# EAGLE design newboard (EAGLE 9.6.2)
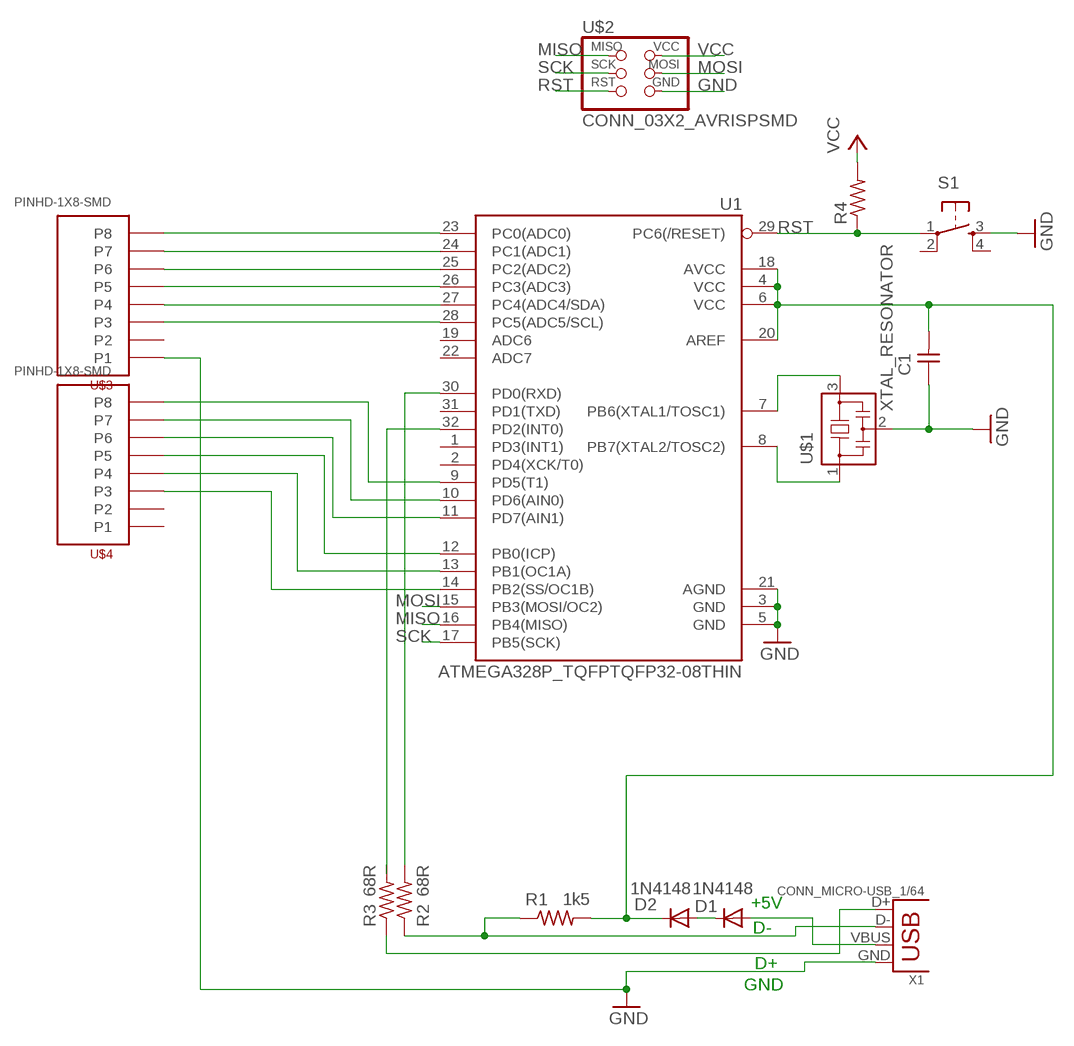
[diagram p0: schematic, sheet 1]

## Parts
C1  CAP_UNPOLARIZEDFAB  [C1206FAB]
D1  1N4148  [DO35-10]
D2  1N4148  [DO35-10]
R1  1k5  R1206FAB  [R1206FAB]
R2  68R  R1206FAB  [R1206FAB]
R3  68R  R1206FAB  [R1206FAB]
R4  R1206FAB  [R1206FAB]
S1  SW_SWITCH_TACTILE_6MM6MM_SWITCH  [6MM_SWITCH]
U1  ATMEGA328P_TQFPTQFP32-08THIN  [TQFP32-08THIN]
U$1  XTAL_RESONATOR  [EFOBM]
U$2  CONN_03X2_AVRISPSMD  [2X03SMD]
U$3  PINHD-1X8-SMD  [1X08SMD]
U$4  PINHD-1X8-SMD  [1X08SMD]
X1  CONN_MICRO-USB_1/64  [DX4R005HJ5_64]

## Nets
GND: C1.1 S1.3(S) U1.3(GND) U1.5(GND) U1.21(AGND) U$1.2 U$2.6(GND) U$3.P1 X1.GND
MISO: U1.16(PB4(MISO)) U$2.1(MISO)
MOSI: U1.15(PB3(MOSI/OC2)) U$2.4(MOSI)
N$1: U1.23(PC0(ADC0)) U$3.P8
N$2: U1.24(PC1(ADC1)) U$3.P7
N$3: U1.7(PB6(XTAL1/TOSC1)) U$1.3
N$4: U1.8(PB7(XTAL2/TOSC2)) U$1.1
N$5: U1.25(PC2(ADC2)) U$3.P6
N$6: U1.26(PC3(ADC3)) U$3.P5
N$7: R2.2 U1.30(PD0(RXD))
N$8: R3.2 U1.32(PD2(INT0))
N$9: U1.27(PC4(ADC4/SDA)) U$3.P4
N$10: U1.28(PC5(ADC5/SCL)) U$3.P3
N$11: U1.9(PD5(T1)) U$4.P8
N$12: U1.10(PD6(AIN0)) U$4.P7
N$13: U1.11(PD7(AIN1)) U$4.P6
N$14: U1.13(PB1(OC1A)) U$4.P4
N$15: U1.14(PB2(SS/OC1B)) U$4.P3
N$18: R1.1 R2.1 X1.D-
N$19: R3.1 X1.D+
N$24: D1.A X1.VBUS
N$25: D1.C D2.A
N$26: U1.12(PB0(ICP)) U$4.P5
RST: R4.1 S1.1(P) U1.29(PC6(/RESET)) U$2.5(RST)
SCK: U1.17(PB5(SCK)) U$2.3(SCK)
VCC: C1.2 D2.C R1.2 R4.2 U1.4(VCC) U1.6(VCC) U1.18(AVCC) U1.20(AREF) U$2.2(VCC)
Unconnected: S1.2(P1) S1.4(S1) U1.1(PD3(INT1)) U1.2(PD4(XCK/T0)) U1.19(ADC6) U1.22(ADC7) U1.31(PD1(TXD)) U$3.P2 U$4.P1 U$4.P2

## Notes on the sheet
- +5V
- D-
- D+
- GND

## Library data of the parts
C1 = 00fab:CAP_UNPOLARIZED
D1 D2 = diode:1N4148: DIODE high speed (Philips)
R1-R4 = 00fab:R: Resistor (US Symbol) Variants with postfix FAB are widened to allow the routing of internal traces
S1 = 00fab:SW_SWITCH_TACTILE_6MM: OMRON SWITCH
U1 = 01fab:ATMEGA328P_TQFP
U$1 = 00fab:XTAL_RESONATOR
U$2 = 00fab:CONN_03X2_AVRISP
U$3 U$4 = 01fab:PINHD-1X8-SMD: M1x08 SMD Header
X1 = 00fab:CONN_MICRO-USB: SMD micro USB connector as found in the fablab inventory. Three footprint variants included: original, as described by manufacturer's datasheet for milling with the 1/100" bit for milling with the 1/64" bit Made by Zaerc.

## Board
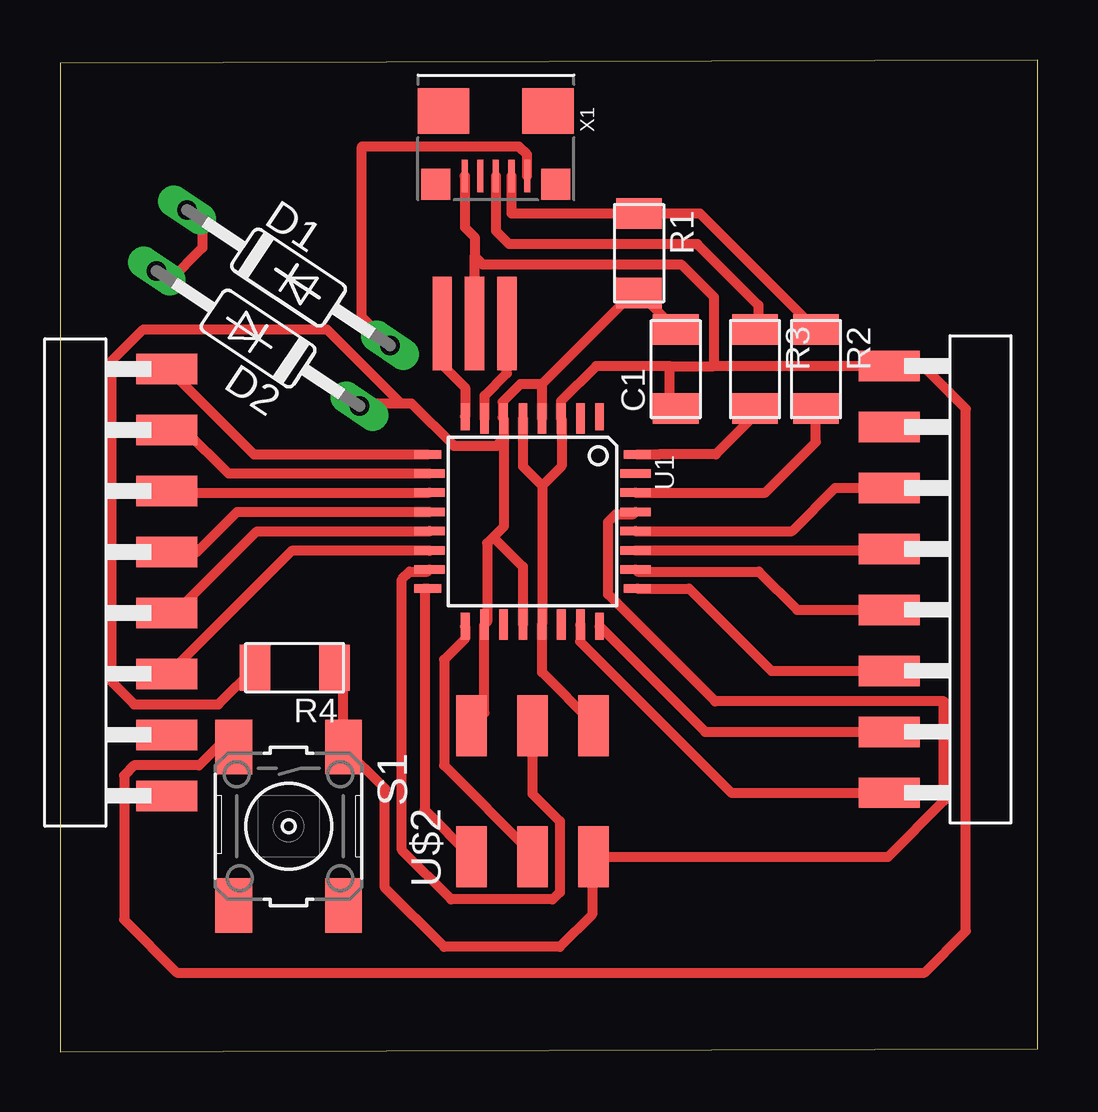
[diagram p1: board, top side]

Size 40.75 x 41.33 mm. Coordinates in mm from the lower left corner, seen from the top.
Outline: 0,0 40.75,0.13 40.75,41.33 0,41.2 0,0
Copper layers (1*16): Top 0.035mm / dielectric 1.5mm / Bottom 0.035mm
Design rules "default *": minimum track width 8mil, minimum drill 0.35mm, track to track 8mil, track to pad 12mil, pad to pad 12mil, via to via 12mil, smd to smd 0mil, copper to edge 40mil, drill to drill 12mil, minimum pad ring 10mil, minimum via ring 8mil, stop-mask expansion 4mil, vias tented up to drill 0mil, thermal gap 10mil

### Footprints (pad centres in the part's own frame; a part is rotated, then mirrored left to right if it is on the bottom)
C1206FAB = smd 1.27 x 1.905: 1 -1.651,0; 2 1.651,0
DO35-10 = drill 0.813 long: A 5.08,0; C -5.08,0
R1206FAB = smd 1.27 x 1.905: 1 -1.651,0; 2 1.651,0
6MM_SWITCH = smd 2.286 x 1.524: 1 -3.302,2.286; 2 3.302,2.286; 3 -3.302,-2.286; 4 3.302,-2.286
TQFP32-08THIN = smd 1.118 x 0.356: 1 -4.369,2.8; 8 -4.369,-2.8; 17 4.369,-2.8; 24 4.369,2.8 | smd 1.27 x 0.356: 2 -4.293,2; 3 -4.293,1.2; 4 -4.293,0.4; 5 -4.293,-0.4; 6 -4.293,-1.2; 7 -4.293,-2; 18 4.293,-2; 19 4.293,-1.2; 20 4.293,-0.4; 21 4.293,0.4; 22 4.293,1.2; 23 4.293,2 | smd 0.356 x 1.118: 9 -2.8,-4.369; 16 2.8,-4.369; 25 2.8,4.369; 32 -2.8,4.369 | smd 0.356 x 1.27: 10 -2,-4.293; 14 1.2,-4.293; 15 2,-4.293; 26 2,4.293; 27 1.2,4.293; 31 -2,4.293 | smd 0.35 x 1.27: 11 -1.2,-4.293; 12 -0.4,-4.293; 13 0.4,-4.293; 28 0.4,4.293; 29 -0.4,4.293; 30 -1.2,4.293
EFOBM = smd 0.8 x 3.9: 1 -1.35,0; 2 0,0; 3 1.35,0
2X03SMD = smd 2.54 x 1.27: 1 -2.54,2.54; 2 2.92,2.54; 3 -2.54,0; 4 2.92,0; 5 -2.54,-2.54; 6 2.92,-2.54
1X08SMD = smd 2.54 x 1.27: P1 0,8.89; P2 0,6.35; P3 0,3.81; P4 0,1.27; P5 0,-1.27; P6 0,-3.81; P7 0,-6.35; P8 0,-8.89
DX4R005HJ5_64 = smd 0.254 x 1.35: D+ 0,1.6; D- -0.65,1.6; GND 1.3,1.6; ID 0.65,1.6; VBUS -1.3,1.6 | smd 1.2 x 1.3: GND@1 -2.5,1.95; GND@2 2.5,1.95 | smd 2.15 x 1.9: GND@3 -2.175,-1.1; GND@4 2.175,-1.1

### Placement (x,y rotation side)
C1  25.65,28.45 90 top
D1  9.53,32.26 326.3 top
D2  8.26,29.72 146.3 top
R1  24.13,33.27 270 top
R2  31.5,28.45 270 top
R3  28.96,28.45 270 top
R4  9.78,16 180 top
S1  9.53,9.4 270 top
U1  19.68,22.1 270 top
U$1  17.27,30.35 0 top
U$2  19.68,10.67 90 top
U$3  34.54,19.68 0 top
U$4  4.45,19.56 180 top
X1  18.16,38.1 180 top

### Tracks (layer width: path | path; a pad name or v marks a point on that pad's centre or on a via)
GND
  Top 0.406: 20.09,23.59 U1.21 20.09,15.81 22.23,13.67 U$2.6 | 20.09,23.59 20.9,24.4 20.9,26.38 U1.3 20.87,26.4 20.87,27.11 22.34,28.57 25.4,28.57 | U1.5 19.29,24.39 20.09,23.59 | 27.24,28.57 U$3.P1 35.97,28.57 37.75,26.79 37.75,5.03 36.02,3.3 4.87,3.3 2.67,5.5 2.67,11.51 3.09,11.94 5.8,11.94 6.56,12.7 S1.3 | C1.1 25.4,27.05 25.4,28.57 | U$1.2 17.27,33.15 | 17.27,33.15 17.27,33.95 16.88,34.35 16.88,36.5 X1.GND | 27.24,28.57 27.24,31.45 25.88,32.81 17.61,32.81 17.27,33.15 | 25.4,28.57 27.24,28.57
MISO
  Top 0.406: U1.16 15.19,19.3 15.19,10.08 U$2.1
MOSI
  Top 0.406: U1.15 15.3,20.01 14.57,20.01 14.25,19.69 14.25,8.4 16.3,6.35 20.53,6.35 20.83,6.65 20.83,9.61 19.68,10.75 U$2.4
N$1
  Top 0.406: U1.23 21.67,17.79 21.67,17.09 27.96,10.79 U$3.P8
N$2
  Top 0.406: U1.24 26.88,13.34 U$3.P7
N$3
  Top 0.406: U1.7 17.7,26.4 17.7,27.34 18.62,28.27 U$1.3
N$4
  Top 0.406: U$1.1 15.86,30.29 15.86,28.7 16.89,27.67 U1.8
N$5
  Top 0.406: U1.25 26.21,19.3 29.64,15.88 U$3.P6
N$6
  Top 0.406: U1.26 24.07,20.01 29.12,20.01 30.71,18.41 U$3.P5
N$7
  Top 0.406: U1.30 29.39,23.3 31.5,25.4 R2.2
N$8
  Top 0.406: U1.32 24.94,24.9 24.95,24.89 27.32,24.89 28.96,26.52 R3.2
N$9
  Top 0.406: U1.27 34.49,20.9 U$3.P4
N$10
  Top 0.406: U$3.P3 32.3,23.49 30.5,21.7 U1.28
N$11
  Top 0.406: U$4.P8 4.53,28.45 8.08,24.9 U1.9
N$12
  Top 0.406: U1.10 7.02,24.1 5.21,25.91 U$4.P7
N$13
  Top 0.406: U$4.P6 4.51,23.3 U1.11
N$14
  Top 0.406: U1.13 15.38,21.68 8.2,21.68 4.81,18.29 U$4.P4
N$15
  Top 0.406: U$4.P3 4.53,15.75 9.65,20.87 15.39,20.87 U1.14
N$18
  Top 0.406: R2.1 26.67,34.93 R1.1 18.81,34.93 X1.D-
N$19
  Top 0.406: R3.1 29.1,30.24 29.1,31.11 26.55,33.66 18.71,33.66 18.16,34.2 X1.D+
N$24
  Top 0.406: X1.VBUS 19.46,37.39 19.13,37.72 12.57,37.72 12.57,30.61 12.58,30.61 D1.A
N$25
  Top 0.406: D1.C 5.93,34.44 5.93,33.49 4.57,32.13 4.17,32.54 D2.A
N$26
  Top 0.406: U$4.P5 5.71,20.83 7.38,22.5 U1.12
RST
  Top 0.406: R4.1 11.81,15.11 S1.1 13.54,10.97 13.54,6.84 16,4.37 20.82,4.37 22.17,5.72 22.17,8.08 U$2.5 34.5,8.13 36.83,10.46 36.83,14.61 27.29,14.61 22.84,19.06 22.84,22.08 23.16,22.41 23.89,22.41 U1.29
SCK
  Top 0.406: U1.17 16.89,17.22 16,16.34 16,11.94 19.68,8.26 U$2.3
VCC
  Top 0.406: 18.48,25.53 U1.6 18.45,26.43 18.45,27.08 19.2,27.83 20.09,27.83 | 18.48,25.53 18.48,21.88 18.05,21.44 | 18.05,21.44 17.8,21.19 17.8,17.92 U1.18 17.68,14.13 U$2.2 | 18.05,21.44 19.29,20.21 U1.20 | 14.2,27.02 11.12,30.1 3.47,30.1 2.16,28.79 2.16,15.41 3.09,14.48 6.6,14.48 R4.2 | 18.48,25.53 18.21,25.25 16.42,25.25 14.65,27.02 14.2,27.02 | C1.2 R1.2 23.88,31.62 20.09,27.83 | U1.4 20.09,27.83 | D2.C 12.61,27.02 14.2,27.02